# EasyEDA Pro project esp32_wheel robot.eprj

# Schematic Schematic1
Board Name: Board1; Create Date: 2026-08-13; Page Name: P1; Project Name: esp32_wheel robot; Schematic Name: Schematic1; Update Date: 2026-08-14; Company: EasyEDA.com; Page Size: A4; Version: V1.0
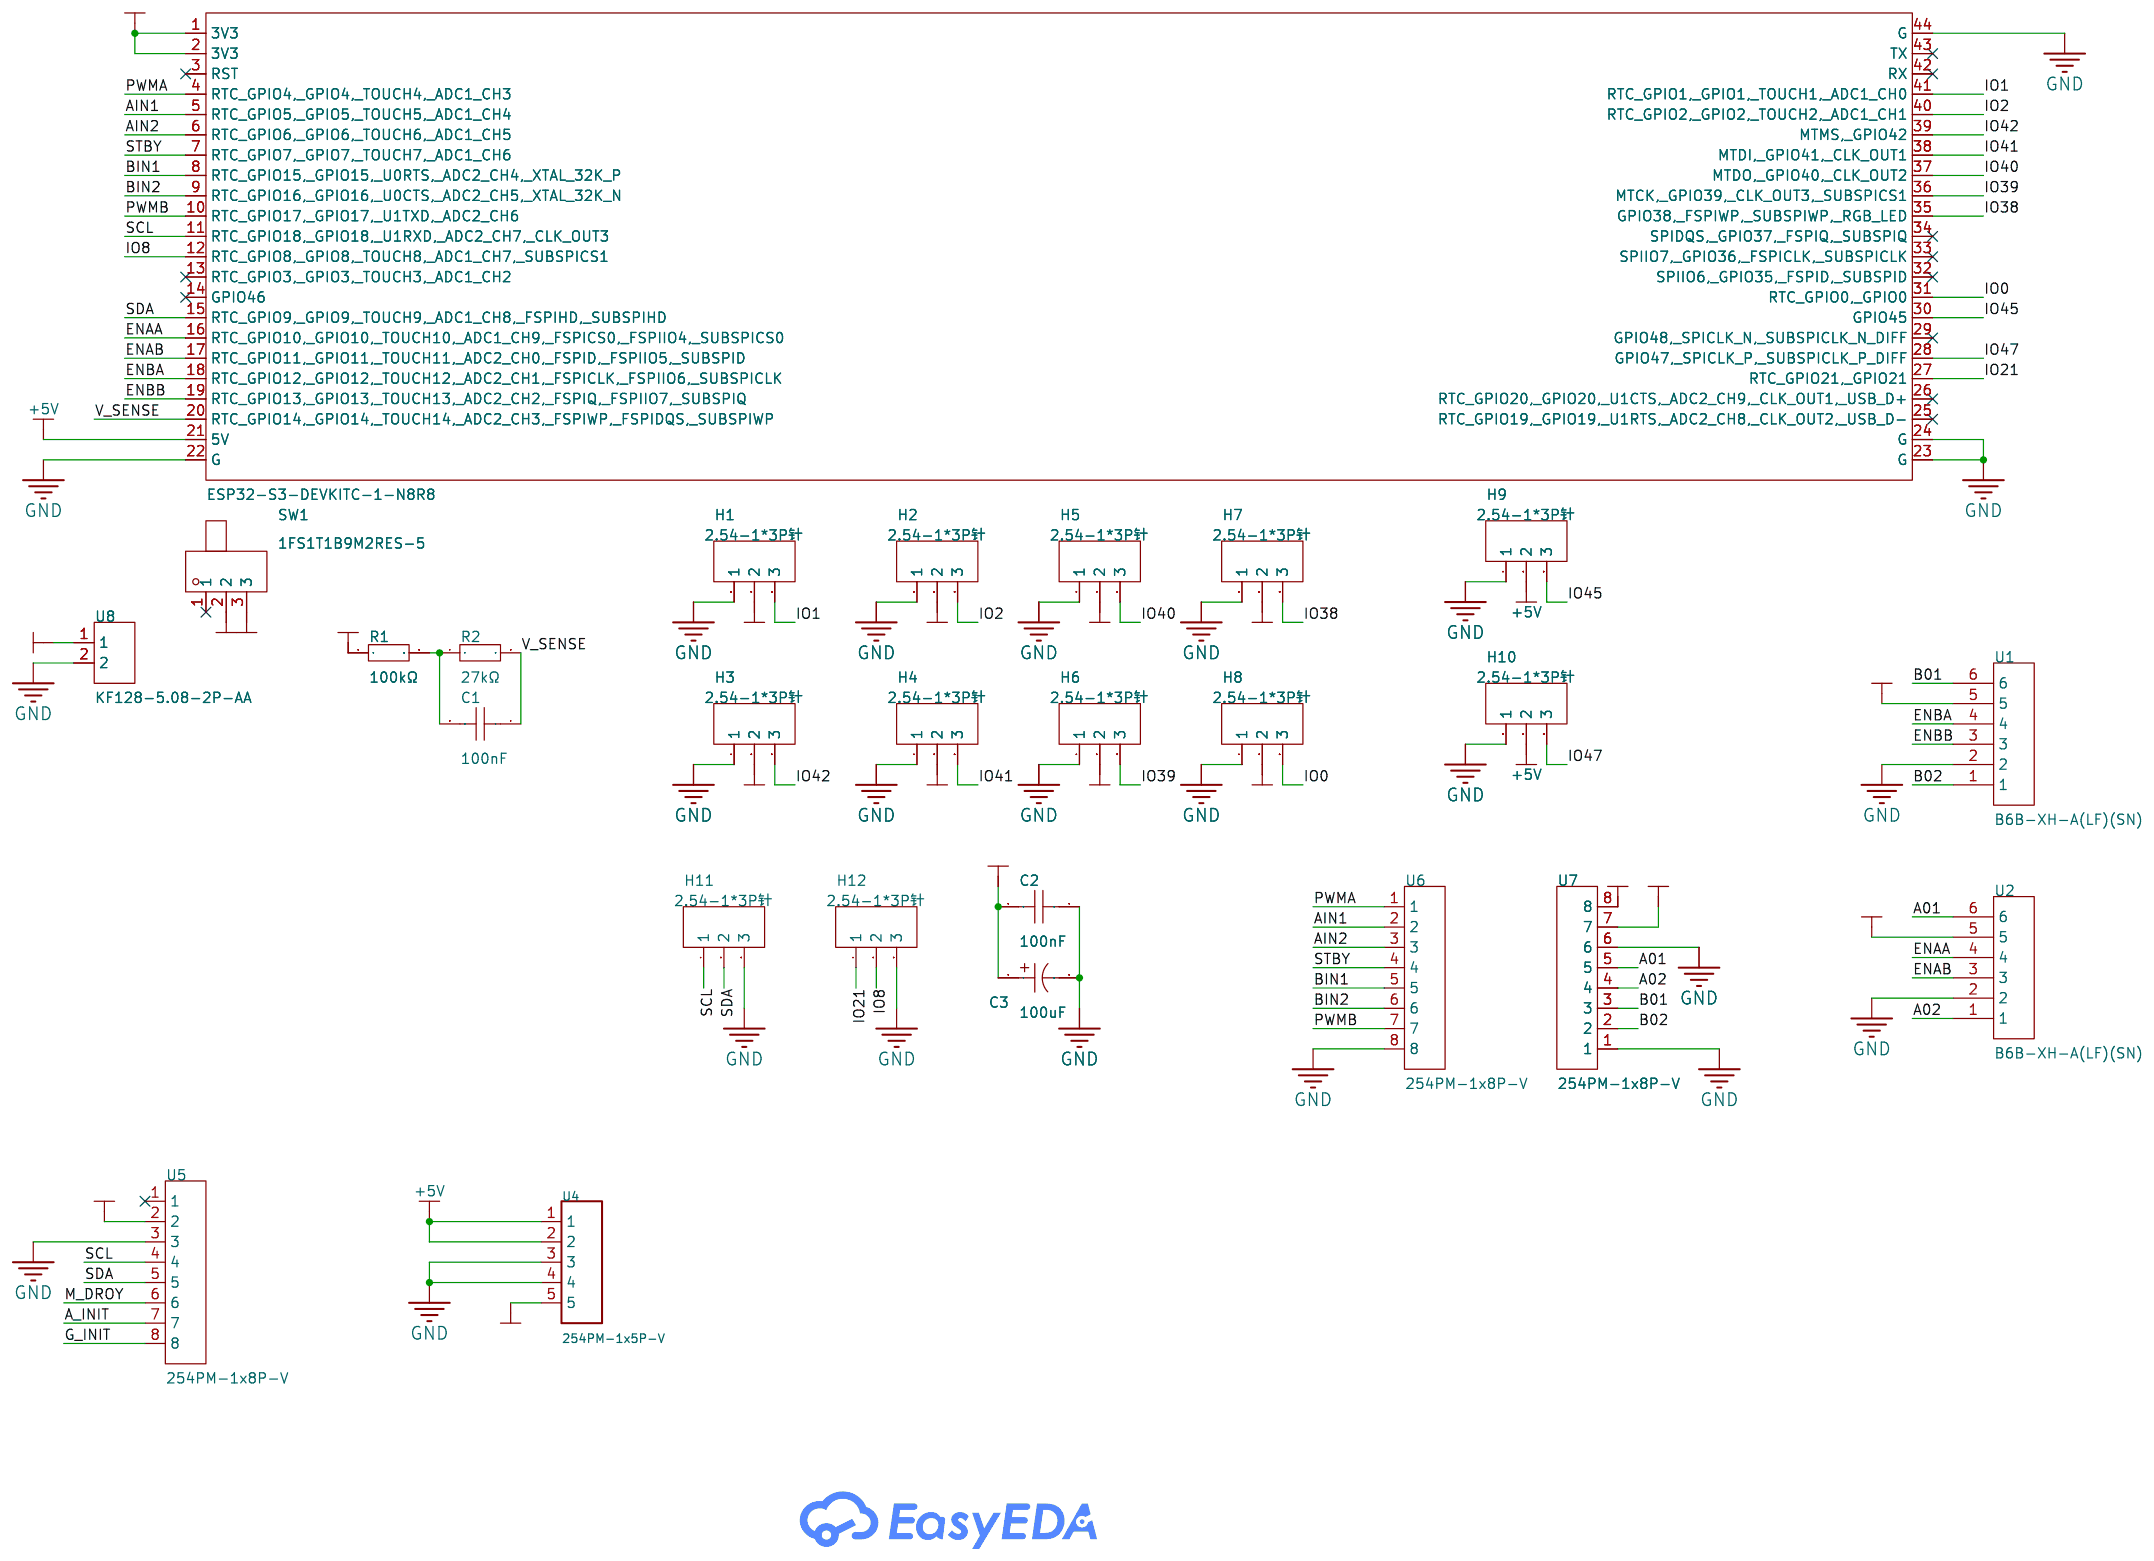
[diagram p0: schematic sheet]

## Parts
C1  100nF  [CAP-TH_L5.0-W2.5-P5.00-D1.0]
C2  100nF  [CAP-TH_L5.0-W2.5-P5.00-D1.0]
C3  100uF  [CAP-TH_BD10.0-P5.00-D0.8-FD_UKZ1E101MPM1TD]
H1  2.54-1*3P针  [HDR-TH_3P-P2.54-V-M-1]
H2  2.54-1*3P针  [HDR-TH_3P-P2.54-V-M-1]
H3  2.54-1*3P针  [HDR-TH_3P-P2.54-V-M-1]
H4  2.54-1*3P针  [HDR-TH_3P-P2.54-V-M-1]
H5  2.54-1*3P针  [HDR-TH_3P-P2.54-V-M-1]
H6  2.54-1*3P针  [HDR-TH_3P-P2.54-V-M-1]
H7  2.54-1*3P针  [HDR-TH_3P-P2.54-V-M-1]
H8  2.54-1*3P针  [HDR-TH_3P-P2.54-V-M-1]
H9  2.54-1*3P针  [HDR-TH_3P-P2.54-V-M-1]
H10  2.54-1*3P针  [HDR-TH_3P-P2.54-V-M-1]
H11  2.54-1*3P针  [HDR-TH_3P-P2.54-V-M-1]
H12  2.54-1*3P针  [HDR-TH_3P-P2.54-V-M-1]
R1  100kΩ  [RES-TH_BD2.3-L6.5-P10.50-D0.5]
R2  27kΩ  [RES-TH_BD2.2-L6.5-P10.50-D0.6]
SW1  1FS1T1B9M2RES-5  [SW-TH_1FS1T1B9M2RES-5]
U1  B6B-XH-A(LF)(SN)  [CONN-TH_6P-P2.50_B6B-XH-A-LF-SN]
U2  B6B-XH-A(LF)(SN)  [CONN-TH_6P-P2.50_B6B-XH-A-LF-SN]
U3  ESP32-S3-DEVKITC-1-N8R8  [CONN-TH_ESP32-S3-DEVKITC-1U-N8]
U4  254PM-1x5P-V  [HDR-TH_5P-P2.54-V-F-3]
U5  254PM-1x8P-V  [HDR-TH_8P-P2.54-V-F_5]
U6  254PM-1x8P-V  [HDR-TH_8P-P2.54-V-F_5]
U7  254PM-1x8P-V  [HDR-TH_8P-P2.54-V-F_5]
U8  KF128-5.08-2P-AA  [CONN-TH_P5.08_KF128-5.08-2P]

## Library data of the parts
C1 C2 = CC1H104MC1FD3F6C10MF: Capacitance:100nF Tolerance:±20% Tolerance:±20% Voltage Rating:50V Pin Spacing:5.08mm Temperature Coefficient:Y5V Diameter:6mm Body Thickness:2.2mm; LCSC Part Name: 100nF ±20% 50V; Supplier Part: C254085; Manufacturer: Dersonic(德尔创); Supplier Footprint: 插件,P=5.08mm; JLCPCB Part Class: Extended Part; Datasheet: https://item.szlcsc.com/datasheet/CC1H104MC1FD3F6C10MF/248635.html; Supplier: LCSC; Tolerance: ±20%; Voltage Rating: 50V; Pin Spacing: 5.08mm; Temperature Coefficient: Y5V; Diameter: 6mm; Body Thickness: 2.2mm
C3 = UKZ1E101MPM1TD: LCSC Part Name: 100uF ±20% 25V; Supplier Part: C1585197; Manufacturer: Nichicon(尼吉康); Supplier Footprint: 插件; JLCPCB Part Class: Extended Part; Datasheet: https://item.szlcsc.com/datasheet/UKZ1E101MPM1TD/1676012.html; Supplier: LCSC; Tolerance: ±20%; Voltage Rating: 25V; Pin Spacing: 5mm; Diameter: 10mm; Lifetime: 1000hrs@85℃; Operating Temperature: -40℃~+85℃; Polarity type: 有极性
H1-H12 = 2.54-1*3P针: LCSC Part Name: 1x3P 间距:2.54mm 方针 直插; Supplier Part: C49257; Manufacturer: BOOMELE(博穆精密); Supplier Footprint: 插件,P=2.54mm; JLCPCB Part Class: Extended Part; Datasheet: https://item.szlcsc.com/datasheet/2.54-1*3P%25E9%2592%2588/50265.html; Supplier: LCSC; Pin Structure: 1x3P; Pitch: 2.54mm; Circluar Pins/Square Pins: Pin Header; Mounting Type: Through Hole; Number of Rows: 1; Number of Pins: 3P; Current Rating: 3A; Length of Mating Pin: 6mm; Insulation Height: 2.5mm; Length of End Connection Pin: 3mm; Contact Material: Brass; Contact Plating: Gold; Operating Temperature: -40℃~+105℃; Color: Black
R1 = MF1/4W-100KΩ±1% T: Type:Metal Film Resistor Resistance:100kΩ Tolerance:±1% Tolerance:±1% Voltage-Supply(Max):250V Power(Watts):250mW Temperature Coefficient:±100ppm/℃ Temperature Coefficient:±100ppm/℃ Operating Temperature:-55℃~+155℃ Operating Temperature:-55℃~+155℃; LCSC Part Name: 100kΩ ±1% 250mW 金属膜电阻 圆柱状直插; Supplier Part: C119369; Manufacturer: CCO(千志电子); Supplier Footprint: 插件,D2.3xL6.5mm; JLCPCB Part Class: Extended Part; Datasheet: https://item.szlcsc.com/datasheet/MF1%252F4W-100K%25CE%25A9%25C2%25B11%2525%2520T/120638.html; Supplier: LCSC; Type: Metal Film Resistor; Tolerance: ±1%; Voltage-Supply(Max): 250V; Power(Watts): 250mW; Temperature Coefficient: ±100ppm/℃; Operating Temperature: -55℃~+155℃
R2 = MF1/4W-27KΩ±1% T: Type:Metal Film Resistors Resistance: Tolerance:±1% Tolerance:±1% Voltage-Supply(Max):250V Power(Watts):250mW Temperature Coefficient:±100ppm/℃ Temperature Coefficient:±100ppm/℃ Operating Temperature:-55℃~+155℃ Operating Temperature:-55℃~+155℃; LCSC Part Name: 27kΩ ±1% 250mW 金属膜电阻 圆柱状直插; Supplier Part: C119356; Manufacturer: CCO(千志电子); Supplier Footprint: 插件,D2.3xL6.5mm; JLCPCB Part Class: Extended Part; Datasheet: https://atta.szlcsc.com/upload/public/pdf/source/20190910/C427326_62A6D058BC0FF74963A2F22379CA06CE.pdf; Supplier: LCSC; Type: Metal Film Resistors; Tolerance: ±1%; Voltage-Supply(Max): 250V; Power(Watts): 250mW; Temperature Coefficient: ±100ppm/℃; Operating Temperature: -55℃~+155℃
SW1 = 1FS1T1B9M2RES-5: LCSC Part Name: 五件套 1FS1T1B9M2RES-5(配2个螺母）; Supplier Part: C496164; Manufacturer: Dailywell(德利威); Supplier Footprint: 插件,12.9x7.9mm; JLCPCB Part Class: Extended Part; Datasheet: https://item.szlcsc.com/datasheet/1FS1T1B9M2RES-5/507563.html; Supplier: LCSC; Circuit: SPDT; Length: 12.9mm; Width: 7.9mm; Life: 100,000 cycles; Current Rating: 6A; Voltage Rating (AC): 125V; Actuator Type: Cylinder Lever; Termination Style: PC Pin; Mounting Type: Through Hole; Operating Temperature: -30℃~+85℃
U1 U2 = B6B-XH-A(LF)(SN): LCSC Part Name: 1x6P 间距:2.5mm 直插 系列:XH; Supplier Part: C144397; Manufacturer: JST; Supplier Footprint: 插件,P=2.5mm; JLCPCB Part Class: Extended Part; Datasheet: https://item.szlcsc.com/datasheet/B6B-XH-A(LF)(SN)/155729.html; Supplier: LCSC; Pins Structure: 1x6P; Pitch: 2.5mm; Mounting Type: Through Hole; Reference Series: XH; Number of Pins: 6P; Number of Rows: 1; Number of PINs Per Row: 6; Current Rating: 3A; Contact Material: Brass; Contact Plating: Tin; Operating Temperature: -25℃~+85℃; Voltage Rating: 250V; Plastic Material: PA66; Flame Retardant Rating: UL94V-0; Supplementary Features: K Pin; Color: White; Z-Height of the Board: 7mm; X-Length of Bottom Edge on Board (Spacing Line): 17.4mm; Y-Width of Bottom Edge on Board: 5.75mm
U3 = ESP32-S3-DEVKITC-1-N8R8: LCSC Part Name: 不带固件; Supplier Part: C20541519; Manufacturer: ESPRESSIF(乐鑫); JLCPCB Part Class: Extended Part; Supplier: LCSC
U4 = 254PM-1x5P-V: LCSC Part Name: 1x5P 间距:2.54mm 直插; Supplier Part: C53202178; Manufacturer: LXWCONN(连兴旺电子); Supplier Footprint: 插件,P=2.54mm; JLCPCB Part Class: Extended Part; Datasheet: https://item.szlcsc.com/datasheet/254PM-1x5P-V/56231326.html; Supplier: LCSC; Holes Structure: 1x5P; Pitch: 2.54mm; Row Spacing: 2.54mm; Circular Hole / Square Hole: Square Hole; Mounting Type: Through Hole; Number of Rows: 1; Number of Positions: 5P; Current Rating: 3A; Holes Direction: Top; Insulation Height: 8.5mm; Contact Material: Brass; Contact Plating: Gold; Operating Temperature: -40℃~+105℃; PIN Length: 3.2mm
U5-U7 = 254PM-1x8P-V: LCSC Part Name: 1x8P 间距:2.54mm 直插; Supplier Part: C53202180; Manufacturer: LXWCONN(连兴旺电子); Supplier Footprint: 插件,P=2.54mm; JLCPCB Part Class: Extended Part; Datasheet: https://item.szlcsc.com/datasheet/254PM-1x8P-V/56231328.html; Supplier: LCSC; Holes Structure: 1x8P; Pitch: 2.54mm; Row Spacing: 2.54mm; Circular Hole / Square Hole: Square Hole; Mounting Type: Through Hole; Number of Rows: 1; Number of Positions: 8P; Current Rating: 3A; Holes Direction: Top; Insulation Height: 8.5mm; Contact Material: Brass; Contact Plating: Gold; Operating Temperature: -40℃~+105℃; PIN Length: 3.2mm
U8 = KF128-5.08-2P-AA: LCSC Part Name: 5.08mm 1x2P 排数:1 每排P数:2 直插; Supplier Part: C474952; Manufacturer: KEFA(科发); Supplier Footprint: 插件,P=5.08mm; JLCPCB Part Class: Extended Part; Datasheet: https://item.szlcsc.com/datasheet/KF128-5.08-2P-AA/481570.html; Supplier: LCSC; Number of Positions or Pins: 1x2P; Pitch: 5.08mm; Color: Green; Mounting Type: Straight; Number of Pins: 2P; Number of Rows: 1; Number of PINs Per Row: 2; Current Rating: 24A; Voltage Rating (Max): 250V; Wire Gauge - AWG: 12~22; Wire Gauge - mm2: 2.5; Operating Temperature: -40℃~+105℃

## Nets
12V: SW1.2 U8.1
+3V3: H1.2 H2.2 H3.2 H4.2 H5.2 H6.2 H7.2 H8.2 U1.5 U2.5 U3.1(3V3) U3.2(3V3) U5.2 U7.7
+5V: H9.2 H10.2 U3.21(5V) U4.1 U4.2
GND: C2.1 C3.2 H1.1 H2.1 H3.1 H4.1 H5.1 H6.1 H7.1 H8.1 H9.1 H10.1 H11.3 H12.3 U1.2 U2.2 U3.22(G) U3.23(G) U3.24(G) U3.44(G) U4.3 U4.4 U5.3 U6.8 U7.1 U7.6 U8.2
A01: U2.6 U7.5
A02: U2.1 U7.4
A_INIT: U5.7
AIN1: U3.5(RTC_GPIO5, GPIO5, TOUCH5, ADC1_CH4) U6.2
AIN2: U3.6(RTC_GPIO6, GPIO6, TOUCH6, ADC1_CH5) U6.3
B01: U1.6 U7.3
B02: U1.1 U7.2
BIN1: U3.8(RTC_GPIO15, GPIO15, U0RTS, ADC2_CH4, XTAL_32K_P) U6.5
BIN2: U3.9(RTC_GPIO16, GPIO16, U0CTS, ADC2_CH5, XTAL_32K_N) U6.6
ENAA: U2.4 U3.16(RTC_GPIO10, GPIO10, TOUCH10, ADC1_CH9, FSPICS0, FSPIIO4, SUBSPICS0)
ENAB: U2.3 U3.17(RTC_GPIO11, GPIO11, TOUCH11, ADC2_CH0, FSPID, FSPIIO5, SUBSPID)
ENBA: U1.4 U3.18(RTC_GPIO12, GPIO12, TOUCH12, ADC2_CH1, FSPICLK, FSPIIO6, SUBSPICLK)
ENBB: U1.3 U3.19(RTC_GPIO13, GPIO13, TOUCH13, ADC2_CH2, FSPIQ, FSPIIO7, SUBSPIQ)
G_INIT: U5.8
IO0: H8.3 U3.31(RTC_GPIO0, GPIO0)
IO1: H1.3 U3.41(RTC_GPIO1, GPIO1, TOUCH1, ADC1_CH0)
IO2: H2.3 U3.40(RTC_GPIO2, GPIO2, TOUCH2, ADC1_CH1)
IO8: H12.2 U3.12(RTC_GPIO8, GPIO8, TOUCH8, ADC1_CH7, SUBSPICS1)
IO21: H12.1 U3.27(RTC_GPIO21, GPIO21)
IO38: H7.3 U3.35(GPIO38, FSPIWP, SUBSPIWP, RGB LED)
IO39: H6.3 U3.36(MTCK, GPIO39, CLK_OUT3, SUBSPICS1)
IO40: H5.3 U3.37(MTDO, GPIO40, CLK_OUT2)
IO41: H4.3 U3.38(MTDI, GPIO41, CLK_OUT1)
IO42: H3.3 U3.39(MTMS, GPIO42)
IO45: H9.3 U3.30(GPIO45)
IO47: H10.3 U3.28(GPIO47, SPICLK_P, SUBSPICLK_P_DIFF)
M_DROY: U5.6
PWMA: U3.4(RTC_GPIO4, GPIO4, TOUCH4, ADC1_CH3) U6.1
PWMB: U3.10(RTC_GPIO17, GPIO17, U1TXD, ADC2_CH6) U6.7
SCL: H11.1 U3.11(RTC_GPIO18, GPIO18, U1RXD, ADC2_CH7, CLK_OUT3) U5.4
SDA: H11.2 U3.15(RTC_GPIO9, GPIO9, TOUCH9, ADC1_CH8, FSPIHD, SUBSPIHD) U5.5
STBY: U3.7(RTC_GPIO7, GPIO7, TOUCH7, ADC1_CH6) U6.4
V_SENSE: C1.1 R2.2 U3.20(RTC_GPIO14, GPIO14, TOUCH14, ADC2_CH3, FSPIWP, FSPIDQS, SUBSPIWP)
VM: C2.2 C3.1 R1.1 SW1.3 U4.5 U7.8
$1N2617: C1.2 R1.2 R2.1

Not connected (* = marked no-connect by the designer): SW1 1*; U3 3(RST)* 13(RTC_GPIO3, GPIO3, TOUCH3, ADC1_CH2)* 14(GPIO46)* 25(RTC_GPIO19, GPIO19, U1RTS, ADC2_CH8, CLK_OUT2, USB_D-)* 26(RTC_GPIO20, GPIO20, U1CTS, ADC2_CH9, CLK_OUT1, USB_D+)* 29(GPIO48, SPICLK_N, SUBSPICLK_N_DIFF)* 32(SPIIO6, GPIO35, FSPID, SUBSPID)* 33(SPIIO7, GPIO36, FSPICLK, SUBSPICLK)* 34(SPIDQS, GPIO37, FSPIQ, SUBSPIQ)* 42(RX)* 43(TX)*; U5 1*

# Board PCB1
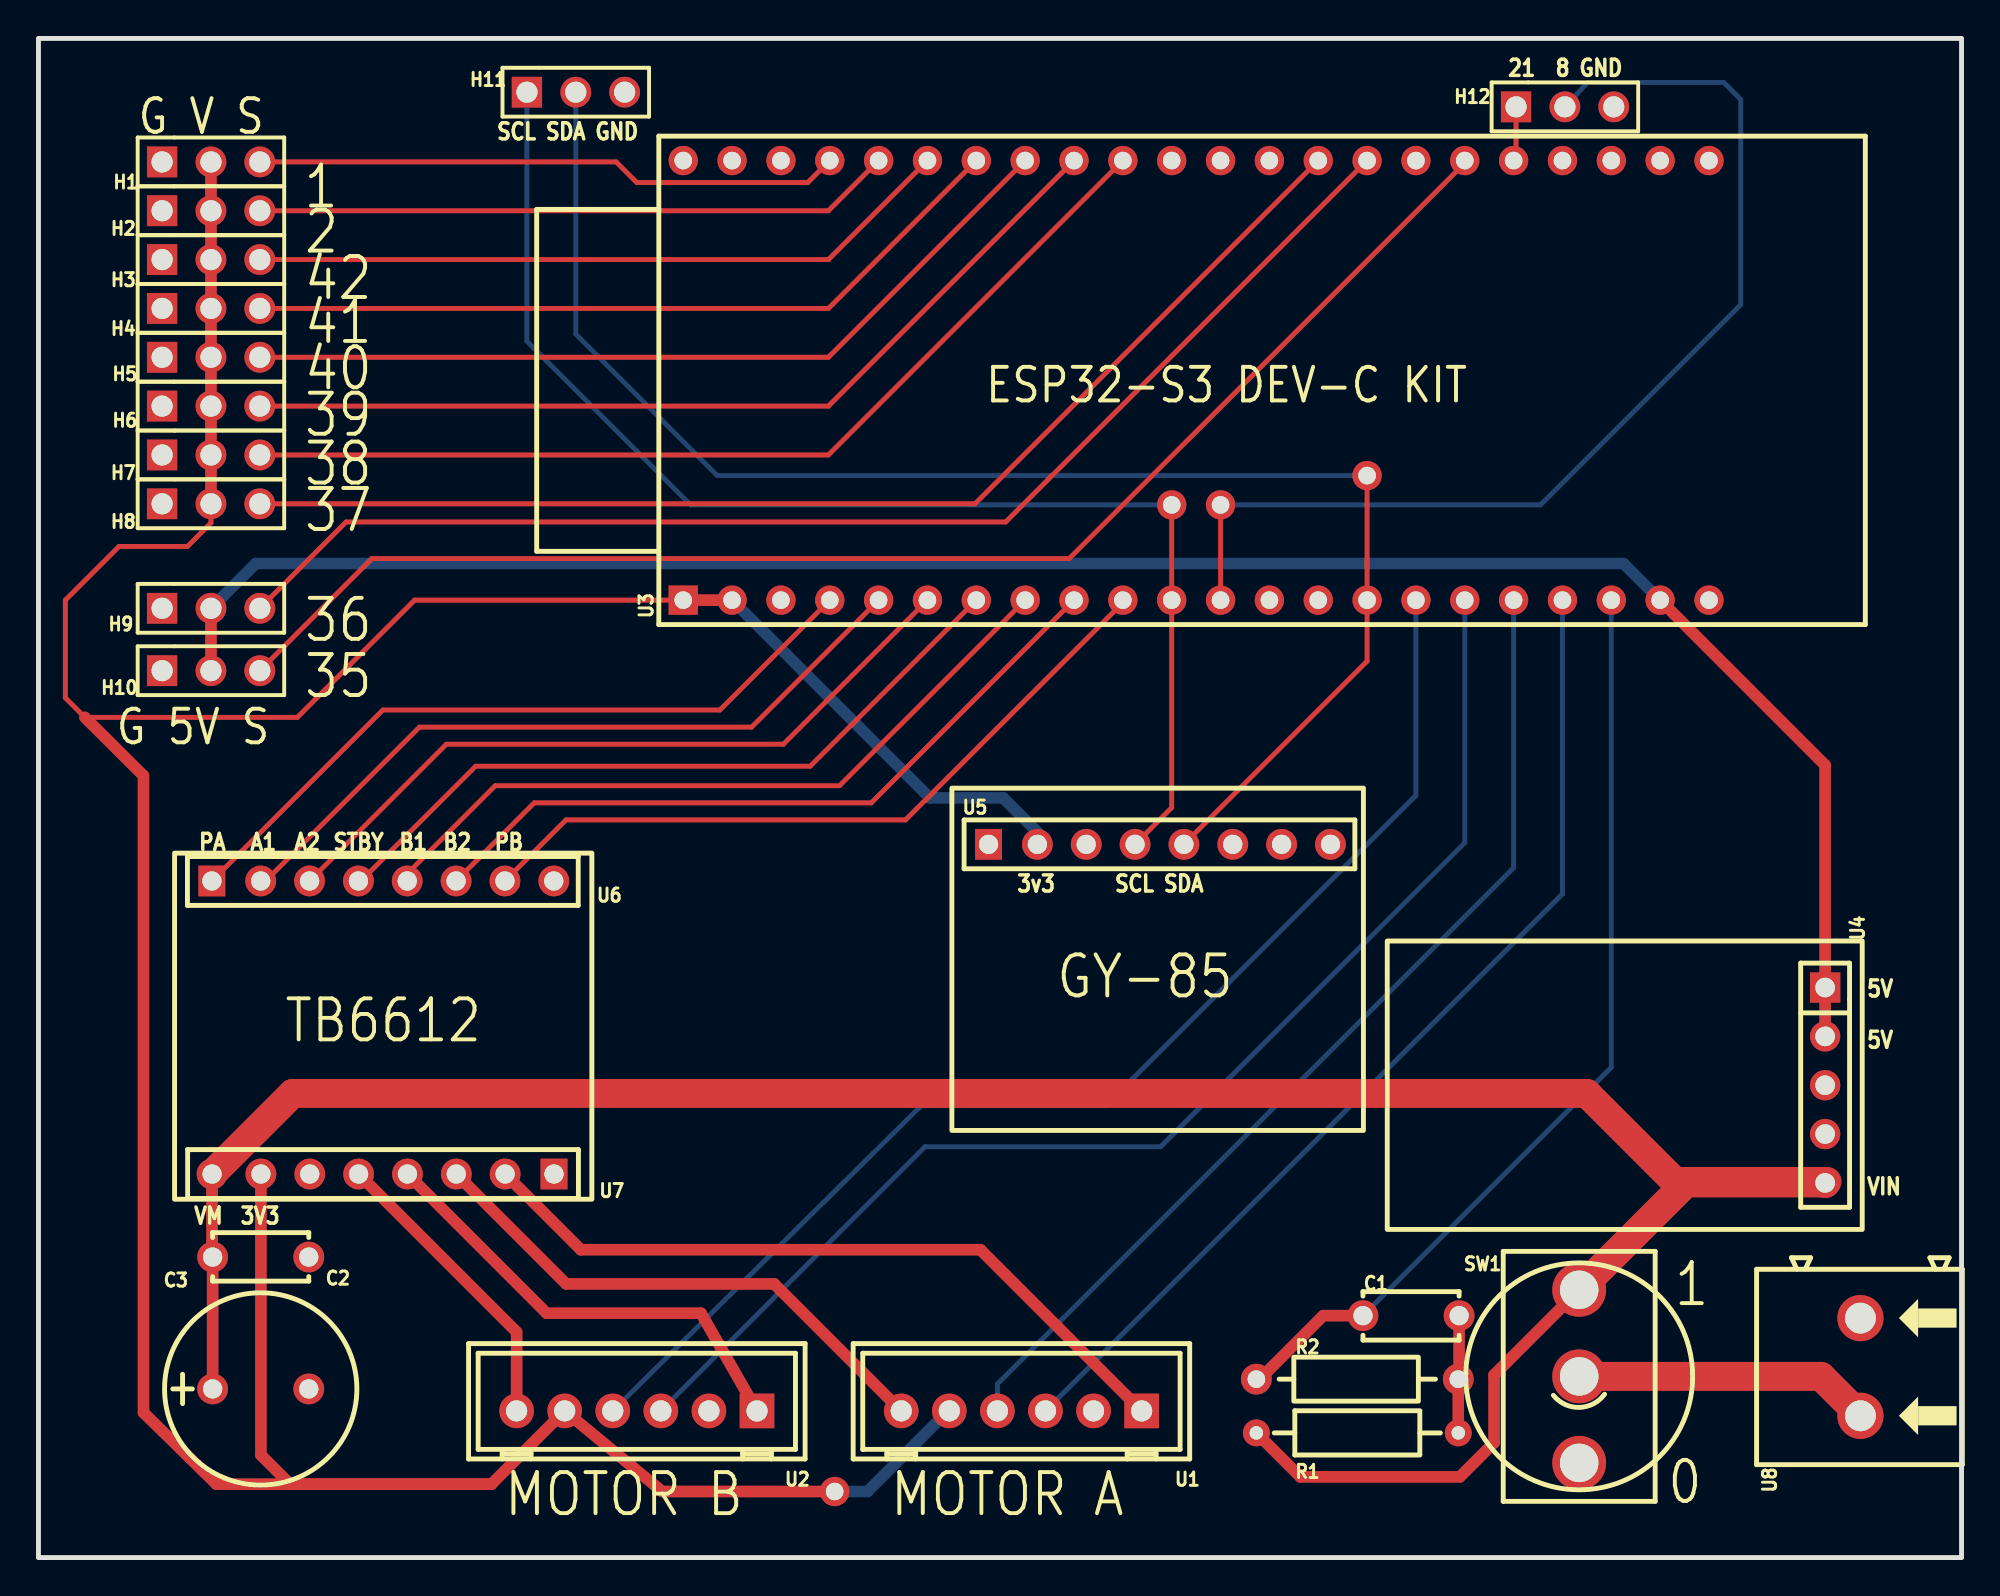
[diagram p1: board, top side]
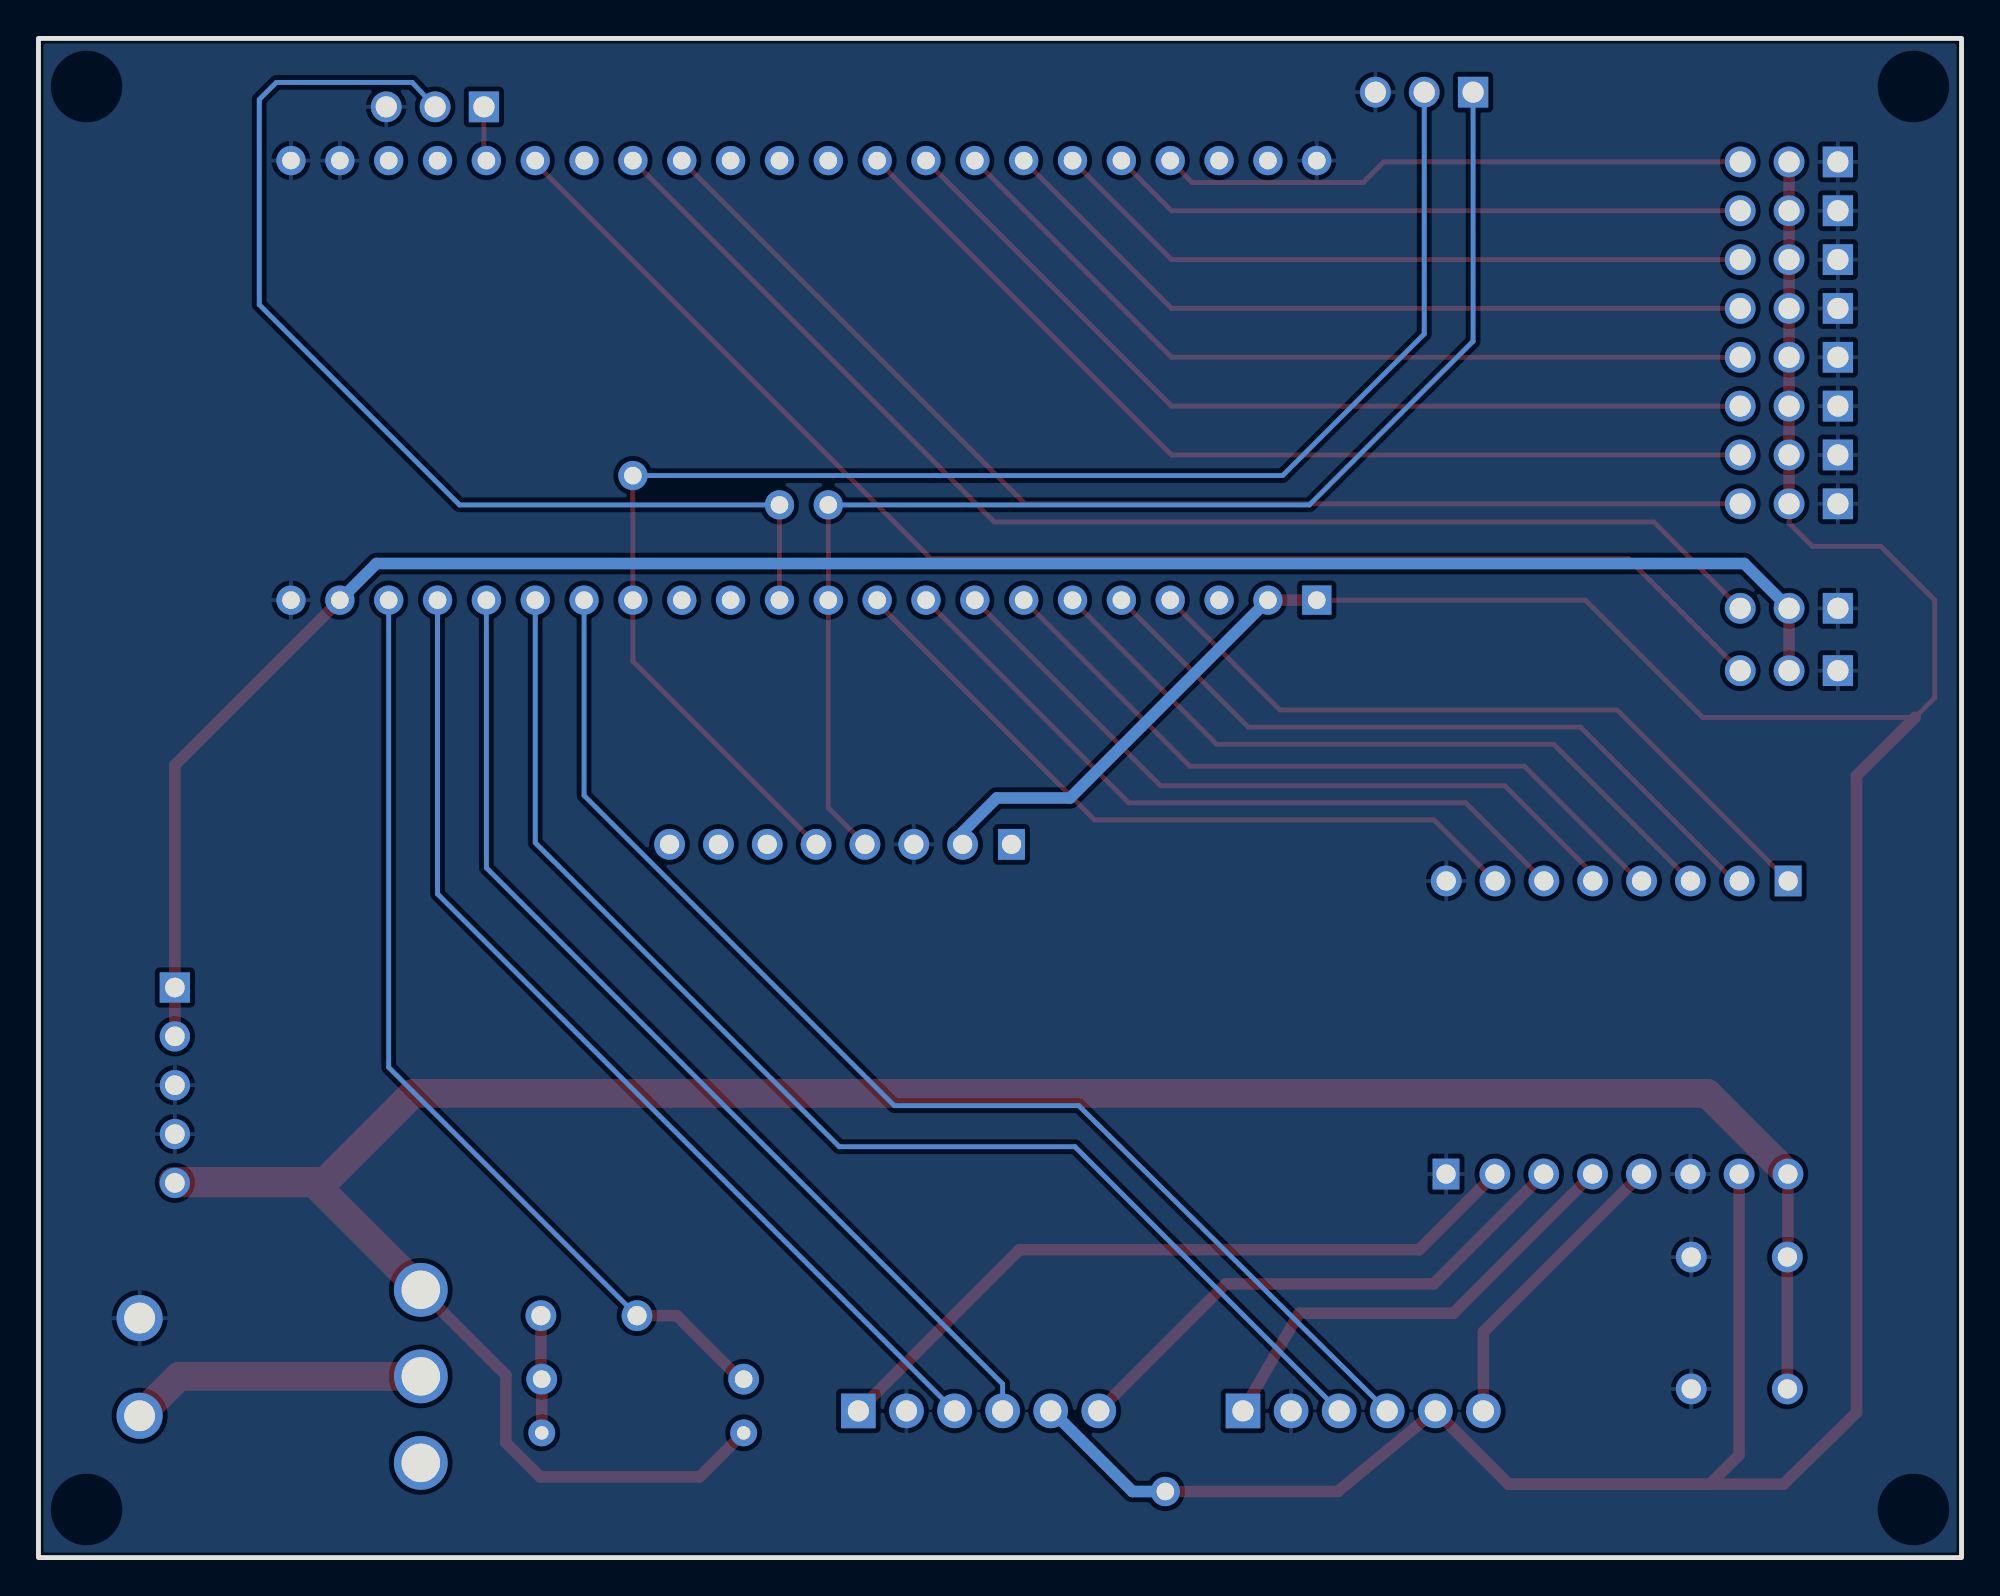
[diagram p2: board, bottom side, seen from below]

Outline 100 x 79 mm; copper layers: Top Layer, Bottom Layer. Coordinates in mm from the lower left corner of the outline.
Outline path: rectangle 0,79 100,0
Stack: Top Layer 0.035mm / Dielectric1 1.51mm FR4 er 4.5 / Bottom Layer 0.035mm

## Design rules (mm)
template: JLCPCB Capability(Two Layers Board)
spacing copperThickness1oz (default): track to track 0.102, other pairs 0.152 to 0.3
spacing copperThickness2oz: track to track 0.203, other pairs 0.152 to 0.3
track width copperThickness1oz (default): min 0.127, default 0.254, max 2.54
track width copperThickness2oz: min 0.203, default 0.254, max 2.54
differential pair differentialPair (default): width min 0.127, default 0.254, max 2.54; gap min 0.152, default 0.152
via viaSize (default): diameter min 0.5, default 0.61, max 10; hole min 0.3, default 0.305, max 6.3

## Placement (name value [footprint] x y rotation side)
C1  100nF  [CAP-TH_L5.0-W2.5-P5.00-D1.0]  71.37 12.58 0 top
C2  100nF  [CAP-TH_L5.0-W2.5-P5.00-D1.0]  11.56 15.63 180 top
C3  100uF  [CAP-TH_BD10.0-P5.00-D0.8-FD_UKZ1E101MPM1TD]  11.56 8.77 0 top
H1  2.54-1*3P针  [HDR-TH_3P-P2.54-V-M-1]  8.97 72.58 0 top
H2  2.54-1*3P针  [HDR-TH_3P-P2.54-V-M-1]  8.97 70.04 0 top
H3  2.54-1*3P针  [HDR-TH_3P-P2.54-V-M-1]  8.97 67.5 0 top
H4  2.54-1*3P针  [HDR-TH_3P-P2.54-V-M-1]  8.97 64.96 0 top
H5  2.54-1*3P针  [HDR-TH_3P-P2.54-V-M-1]  8.97 62.42 0 top
H6  2.54-1*3P针  [HDR-TH_3P-P2.54-V-M-1]  8.97 59.88 0 top
H7  2.54-1*3P针  [HDR-TH_3P-P2.54-V-M-1]  8.97 57.34 0 top
H8  2.54-1*3P针  [HDR-TH_3P-P2.54-V-M-1]  8.97 54.8 0 top
H9  2.54-1*3P针  [HDR-TH_3P-P2.54-V-M-1]  8.97 49.36 0 top
H10  2.54-1*3P针  [HDR-TH_3P-P2.54-V-M-1]  8.97 46.12 0 top
H11  2.54-1*3P针  [HDR-TH_3P-P2.54-V-M-1]  27.94 76.21 0 top
H12  2.54-1*3P针  [HDR-TH_3P-P2.54-V-M-1]  79.38 75.44 0 top
NOREF  -  [Pad_e4691]  41.4 3.44 0 top
NOREF#2  -  [Pad_e6184]  69.09 56.27 0 top
NOREF#3  -  [Pad_e6297]  61.47 54.74 0 top
NOREF#4  -  [Pad_e6182]  58.93 54.74 0 top
R1  100kΩ  [RES-TH_BD2.3-L6.5-P10.50-D0.5]  68.58 6.48 0 top
R2  27kΩ  [RES-TH_BD2.2-L6.5-P10.50-D0.6]  68.58 9.28 180 top
SW1  1FS1T1B9M2RES-5  [SW-TH_1FS1T1B9M2RES-5]  80.12 9.42 0 top
U1  B6B-XH-A(LF)(SN)  [CONN-TH_6P-P2.50_B6B-XH-A-LF-SN]  51.12 7.63 180 top
U2  B6B-XH-A(LF)(SN)  [CONN-TH_6P-P2.50_B6B-XH-A-LF-SN]  31.12 7.63 180 top
U3  ESP32-S3-DEVKITC-1-N8R8  [CONN-TH_ESP32-S3-DEVKITC-1U-N8]  60.2 61.22 90 top
U4  254PM-1x5P-V  [HDR-TH_5P-P2.54-V-F-3]  92.91 24.56 270 top
U5  254PM-1x8P-V  [HDR-TH_8P-P2.54-V-F_5]  58.29 37.09 0 top
U6  254PM-1x8P-V  [HDR-TH_8P-P2.54-V-F_5]  17.91 35.19 0 top
U7  254PM-1x8P-V  [HDR-TH_8P-P2.54-V-F_5]  17.92 19.94 180 top
U8  KF128-5.08-2P-AA  [CONN-TH_P5.08_KF128-5.08-2P]  94.74 9.91 90 top

## Footprints (pads in the part's own frame, mm; a bottom-side part is the same pattern mirrored in y, then rotated)
CAP-TH_BD10.0-P5.00-D0.8-FD_UKZ1E101MPM1TD
  round 1.6 hole 1: 1(-2.5,0) 2(2.5,0)
CAP-TH_L5.0-W2.5-P5.00-D1.0
  round 1.6 hole 1: 1(-2.5,0) 2(2.5,0)
CONN-TH_6P-P2.50_B6B-XH-A-LF-SN
  rect 1.8x1.8 hole 1.1: 1(-6.251,0.001)
  round 1.8 hole 1.1: 2(-3.749,-0.001) 3(-1.249,-0.001) 4(1.251,-0.001) 5(3.751,-0.001) 6(6.251,-0.001)
CONN-TH_ESP32-S3-DEVKITC-1U-N8
  rect 1.524x1.524 hole 0.914: 1(-11.43,26.67)
  round 1.524 hole 0.914: 2(-11.43,24.13) 3(-11.43,21.59) 4(-11.43,19.05) 5(-11.43,16.51) 6(-11.43,13.97) 7(-11.43,11.43) 8(-11.43,8.89) 9(-11.43,6.35) 10(-11.43,3.81) 11(-11.43,1.27) 12(-11.43,-1.27) 13(-11.43,-3.81) 14(-11.43,-6.35) 15(-11.43,-8.89) 16(-11.43,-11.43) 17(-11.43,-13.97) 18(-11.43,-16.51) 19(-11.43,-19.05) 20(-11.43,-21.59) 21(-11.43,-24.13) 22(-11.43,-26.67) 23(11.43,-26.67) 24(11.43,-24.13) 25(11.43,-21.59) 26(11.43,-19.05) 27(11.43,-16.51) 28(11.43,-13.97) 29(11.43,-11.43) 30(11.43,-8.89) 31(11.43,-6.35) 32(11.43,-3.81) 33(11.43,-1.27) 34(11.43,1.27) 35(11.43,3.81) 36(11.43,6.35) 37(11.43,8.89) 38(11.43,11.43) 39(11.43,13.97) 40(11.43,16.51) 41(11.43,19.05) 42(11.43,21.59) 43(11.43,24.13) 44(11.43,26.67)
CONN-TH_P5.08_KF128-5.08-2P
  round 2.4 hole 1.6: 1(-2.54,0) 2(2.54,0)
HDR-TH_3P-P2.54-V-M-1
  rect 1.575x1.6 hole 1.1: 1(-2.54,0)
  round 1.6 hole 1.1: 2(0,0) 3(2.54,0)
HDR-TH_5P-P2.54-V-F-3
  rect 1.575x1.575 hole 1.02: 1(-5.08,0)
  round 1.575 hole 1.02: 2(-2.54,0) 3(0,0) 4(2.54,0) 5(5.08,0)
HDR-TH_8P-P2.54-V-F_5
  rect 1.4x1.6 hole 1: 1(-8.89,0)
  round 1.6 hole 1: 2(-6.35,0) 3(-3.81,0) 4(-1.27,0) 5(1.27,0) 6(3.81,0) 7(6.35,0) 8(8.89,0)
Pad_e4691
  round 1.524 hole 0.914: 1(0,0)
Pad_e6182
  round 1.524 hole 0.914: 1(0,0)
Pad_e6184
  round 1.524 hole 0.914: 1(0,0)
Pad_e6297
  round 1.524 hole 0.914: 1(0,0)
RES-TH_BD2.2-L6.5-P10.50-D0.6
  round 1.6 hole 0.914: 1(-5.25,0) 2(5.25,0)
RES-TH_BD2.3-L6.5-P10.50-D0.5
  round 1.4 hole 0.7: 1(-5.25,0) 2(5.25,0)
SW-TH_1FS1T1B9M2RES-5
  round 2.8 hole 2: 1(0,-4.5) 2(0,0) 3(0,4.5)

## Nets
As in the schematic, except:
+3V3: H1.2 H2.2 H3.2 H4.2 H5.2 H6.2 H7.2 H8.2 NOREF.1 U1.5 U2.5 U3.1 U3.2 U5.2 U7.7
IO8: H12.2 NOREF#3.1 U3.12
SCL: H11.1 NOREF#4.1 U3.11 U5.4
SDA: H11.2 NOREF#2.1 U3.15 U5.5

Pads without a net: SW1 1; U3 3 13 14 25 26 29 32 33 34 42 43; U5 1

## Routing (per net, layer and track width the routed paths; a pad name or vN(x,y) marks a point on that pad's centre or on a via; arc(x,y) is an arc through that point)
VM: length 137.6
  Top Layer w0.6: U7.8 9.03,15.66 C2.2 ; 9.06,15.64 9.06,8.9 9.06,8.94 ; R1.1 65.62,4.2 73.91,4.2 75.69,5.97 75.69,9.5 SW1.3
  Top Layer w1.5: U7.8 13.22,24.14 80.52,24.14 85.09,19.56 93,19.56 ; SW1.3 85.68,19.48 U4.5
12V: length 15.5
  Top Layer w1.5: SW1.2 92.69,9.42 U8.1
+5V: length 106.8
  Top Layer w0.6: 8.97,45.88 H9.2 ; U3.21 92.91,41.21 U4.1 U4.2
  Bottom Layer w0.6: H9.2 11.3,51.69 82.42,51.69 U3.21
A01: length 15.7
  Top Layer w0.6: U7.5 24.86,11.73 U2.6
A02: length 24.1
  Top Layer w0.6: U7.4 26.43,12.71 34.45,12.71 U2.1
AIN1: length 37.9
  Top Layer w0.25: 11.81,35.19 19.81,43.19 37.08,43.19 U3.5
AIN2: length 38.2
  Top Layer w0.25: U6.3 21.21,42.3 38.74,42.3 U3.6
B01: length 28.2
  Top Layer w0.6: U7.3 27.44,14.23 38.26,14.23 U1.6
B02: length 38.2
  Top Layer w0.6: U7.2 28.2,16.01 48.98,16.01 U1.1
BIN1: length 38.5
  Top Layer w0.25: 19.05,35.44 23.75,40.14 41.66,40.14 51.3,49.79 51.3,50.04
BIN2: length 38.2
  Top Layer w0.254: U6.6 25.78,39.25 43.31,39.25 U3.9
ENAA: length 65.1
  Bottom Layer w0.254: U2.4 45.91,23.5 55.5,23.5 71.63,39.63 U3.16
ENAB: length 66.7
  Bottom Layer w0.254: U2.3 46.1,21.36 58.36,21.36 74.17,37.18 U3.17
ENBA: length 53.3
  Bottom Layer w0.254: U1.4 49.86,9.03 76.71,35.87 U3.18
ENBB: length 53.3
  Bottom Layer w0.254: U1.3 79.25,34.51 U3.19
IO0: length 62.4
  Top Layer w0.254: H8.3 48.7,54.8 U3.31
IO1: length 30.6
  Top Layer w0.254: H1.3 30.04,72.58 31.12,71.51 40,71.51 U3.41
IO2: length 33.3
  Top Layer w0.254: H2.3 41.08,70.04 U3.40
IO21: length 2.8
  Top Layer w0.254: H12.1 76.84,72.78 U3.27
IO38: length 51.2
  Top Layer w0.254: H7.3 41.08,57.34 U3.35
IO39: length 47.6
  Top Layer w0.254: H6.3 41.08,59.88 U3.36
IO40: length 44
  Top Layer w0.254: H5.3 41.08,62.42 U3.37
IO41: length 40.4
  Top Layer w0.254: H4.3 41.08,64.96 U3.38
IO42: length 36.9
  Top Layer w0.254: H3.3 41.08,67.5 U3.39
IO45: length 67.2
  Top Layer w0.254: H9.3 16,53.85 50.29,53.85 U3.30
IO47: length 73.6
  Top Layer w0.254: H10.3 17.34,51.95 53.59,51.95 74.17,72.52
PWMA: length 38.2
  Top Layer w0.25: U6.1 17.91,44.08 35.43,44.08 U3.4
PWMB: length 38.3
  Top Layer w0.254: U6.7 27.43,38.36 45.09,38.36 56.39,49.66 U3.10
SCL: length 68.3
  Top Layer w0.254: U5.4 58.93,39 58.93,49.91 ; U3.11 NOREF.1
  Bottom Layer w0.254: 25.4,75.95 25.4,63.25 33.91,54.74 NOREF.1
STBY: length 38.2
  Top Layer w0.25: 16.76,35.19 22.73,41.15 40.13,41.15 U3.7 48.9,49.79
V_SENSE: length 49.5
  Top Layer w0.6: 63.36,9.13 66.81,12.58 C1.1
  Bottom Layer w0.254: C1.1 81.79,25.49 U3.20
$1N2617: length 6.1
  Top Layer w0.6: 73.91,6.48 73.83,6.57 R2.1 73.87,9.32 C1.2

## Copper pours and planes (outline as drawn; the poured copper is in the pictures)
GND on Bottom Layer: -2.29,80.02 101.6,80.02 101.6,-2.28 -2.29,-2.28

## Text on the board
Top Silkscreen Layer: SCL SDA GND | 21  8 GND | VM | PA | 3V3 | A1 | A2 | STBY | B1 | B2 | PB | 3v3 | SCL | SDA | 5V | VIN | G 5V S | G V S | ESP32-S3 DEV-C KIT | TB6612 | 1 | 2 | 42 | 41 | 40 | 39 | 38 | 37 | 36 | 35 | MOTOR B | MOTOR A | GY-85 | 0
